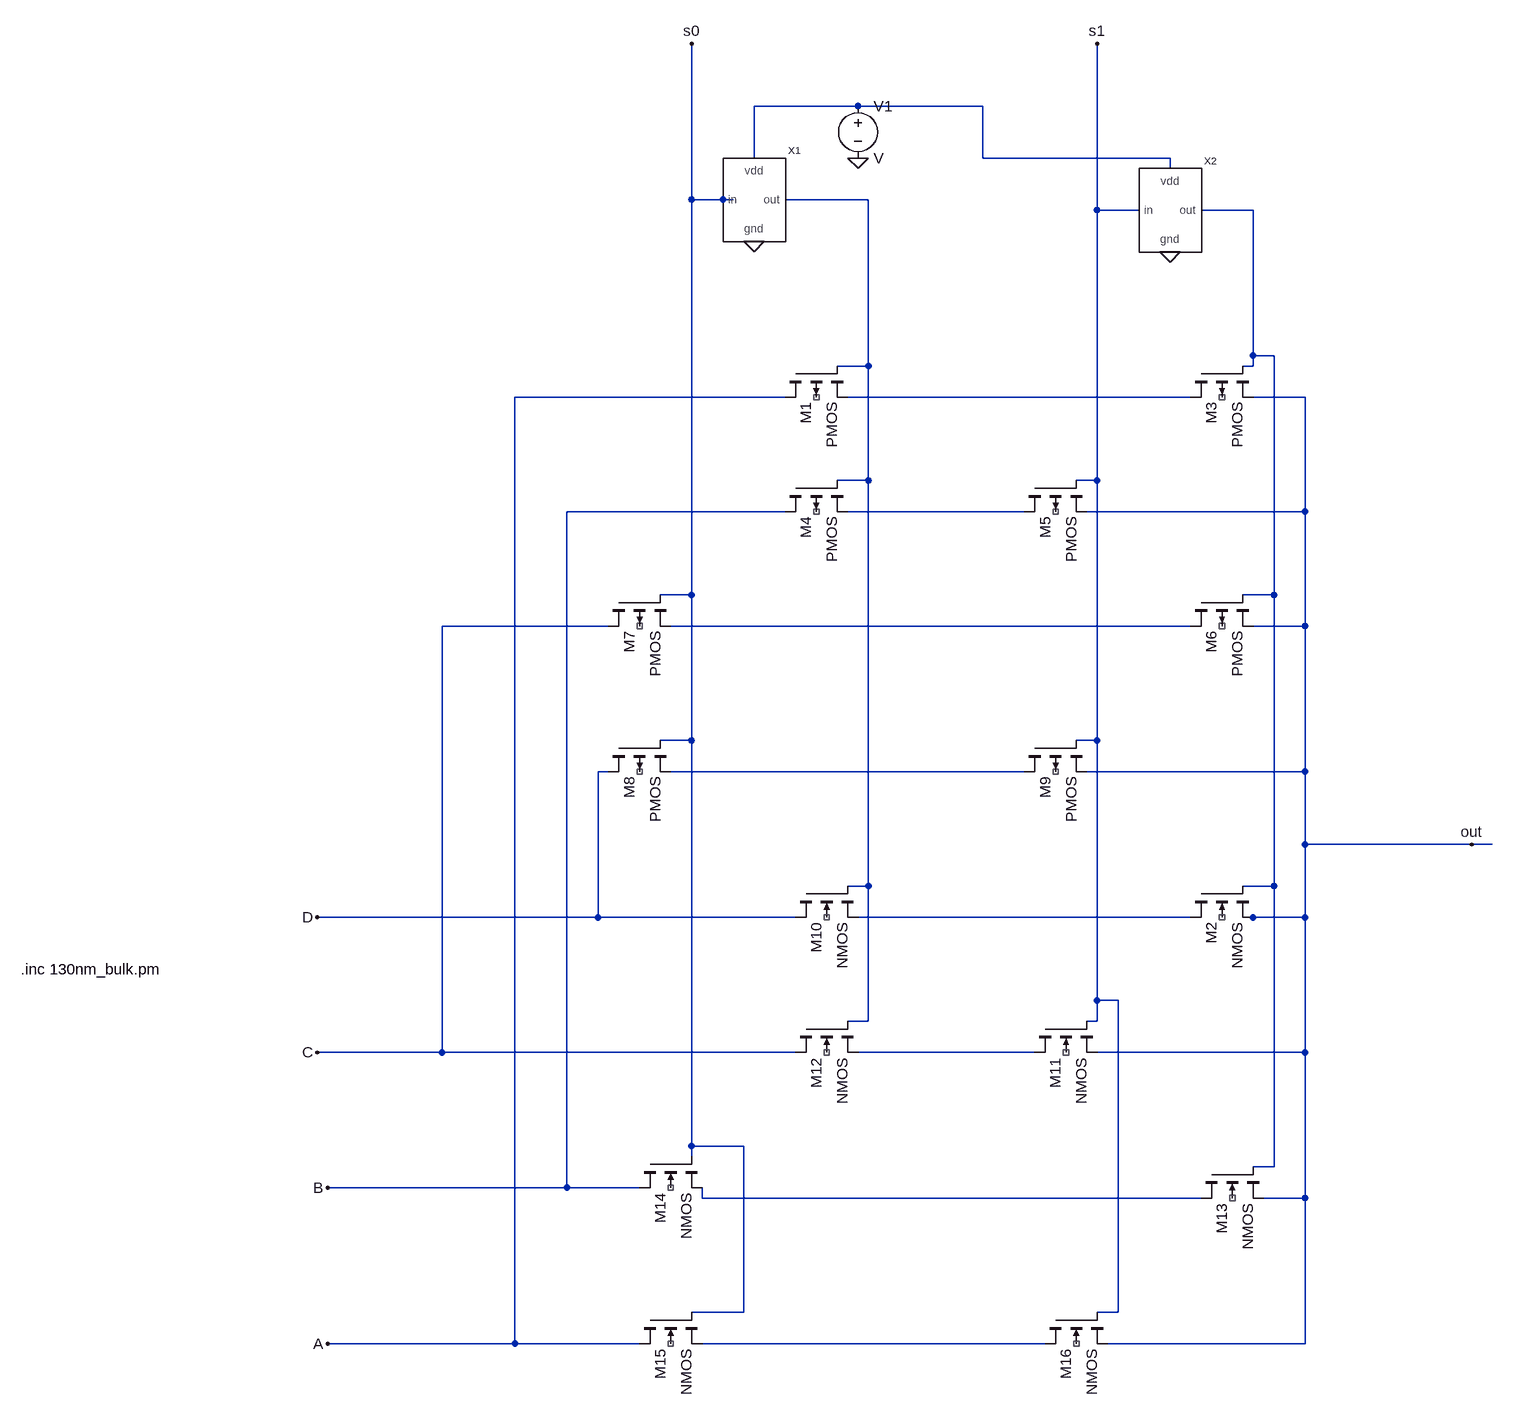
[diagram p0: schematic multiplexor.asc]
multiplexor.asc, the LTspice schematic file:
Version 4
SHEET 1 1380 724
WIRE 400 -1264 240 -1264
WIRE 592 -1264 400 -1264
WIRE 240 -1184 240 -1264
WIRE 592 -1184 592 -1264
WIRE 880 -1184 592 -1184
WIRE 880 -1168 880 -1184
WIRE 144 -1120 144 -1360
WIRE 192 -1120 144 -1120
WIRE 208 -1120 192 -1120
WIRE 416 -1120 288 -1120
WIRE 768 -1104 768 -1360
WIRE 832 -1104 768 -1104
WIRE 1008 -1104 928 -1104
WIRE 1008 -880 1008 -1104
WIRE 1040 -880 1008 -880
WIRE 416 -864 416 -1120
WIRE 416 -864 368 -864
WIRE 1008 -864 1008 -880
WIRE 1008 -864 992 -864
WIRE 288 -816 -128 -816
WIRE 912 -816 384 -816
WIRE 1088 -816 1008 -816
WIRE 416 -688 416 -864
WIRE 416 -688 368 -688
WIRE 768 -688 768 -1104
WIRE 768 -688 736 -688
WIRE 288 -640 -48 -640
WIRE 656 -640 384 -640
WIRE 1088 -640 1088 -816
WIRE 1088 -640 752 -640
WIRE 144 -512 144 -1120
WIRE 144 -512 96 -512
WIRE 1040 -512 1040 -880
WIRE 1040 -512 992 -512
WIRE 16 -464 -240 -464
WIRE 912 -464 112 -464
WIRE 1088 -464 1088 -640
WIRE 1088 -464 1008 -464
WIRE 144 -288 144 -512
WIRE 144 -288 96 -288
WIRE 768 -288 768 -688
WIRE 768 -288 736 -288
WIRE 16 -240 0 -240
WIRE 656 -240 112 -240
WIRE 1088 -240 1088 -464
WIRE 1088 -240 752 -240
WIRE 1088 -128 1088 -240
WIRE 1344 -128 1088 -128
WIRE 1376 -128 1344 -128
WIRE 416 -64 416 -688
WIRE 416 -64 384 -64
WIRE 1040 -64 1040 -512
WIRE 1040 -64 992 -64
WIRE 0 -16 0 -240
WIRE 0 -16 -432 -16
WIRE 304 -16 0 -16
WIRE 912 -16 400 -16
WIRE 1008 -16 992 -16
WIRE 1088 -16 1088 -128
WIRE 1088 -16 1008 -16
WIRE 768 112 768 -288
WIRE 800 112 768 112
WIRE 416 144 416 -64
WIRE 416 144 384 144
WIRE 768 144 768 112
WIRE 768 144 752 144
WIRE -240 192 -240 -464
WIRE -240 192 -432 192
WIRE 304 192 -240 192
WIRE 672 192 400 192
WIRE 1088 192 1088 -16
WIRE 1088 192 768 192
WIRE 144 336 144 -288
WIRE 224 336 144 336
WIRE 144 352 144 336
WIRE 1040 368 1040 -64
WIRE 1040 368 1008 368
WIRE -48 400 -48 -640
WIRE -48 400 -416 400
WIRE 64 400 -48 400
WIRE 160 416 160 400
WIRE 928 416 160 416
WIRE 1088 416 1088 192
WIRE 1088 416 1024 416
WIRE 224 592 224 336
WIRE 224 592 144 592
WIRE 800 592 800 112
WIRE 800 592 768 592
WIRE -128 640 -128 -816
WIRE -128 640 -416 640
WIRE 64 640 -128 640
WIRE 688 640 160 640
WIRE 1088 640 1088 416
WIRE 1088 640 784 640
FLAG 1344 -128 out
FLAG -416 640 A
FLAG -416 400 B
FLAG -432 192 C
FLAG -432 -16 D
FLAG 400 -1184 0
FLAG 240 -1056 0
FLAG 880 -1040 0
FLAG 144 -1360 s0
FLAG 768 -1360 s1
SYMBOL pmos4 288 -864 M90
SYMATTR InstName M1
SYMATTR Value2 l=130e-9 w=2600e-9 ad=676000e-18 as=676000e-18 pd=3640e-9 ps=3640e-9
SYMBOL nmos4 912 -64 M90
SYMATTR InstName M2
SYMATTR Value2 l=130e-9 w=1300e-9 ad=676000e-18 as=676000e-18 pd=3640e-9 ps=3640e-9
SYMBOL pmos4 912 -864 M90
SYMATTR InstName M3
SYMATTR Value2 l=130e-9 w=2600e-9 ad=676000e-18 as=676000e-18 pd=3640e-9 ps=3640e-9
SYMBOL pmos4 288 -688 M90
SYMATTR InstName M4
SYMATTR Value2 l=130e-9 w=2600e-9 ad=676000e-18 as=676000e-18 pd=3640e-9 ps=3640e-9
SYMBOL pmos4 656 -688 M90
SYMATTR InstName M5
SYMATTR Value2 l=130e-9 w=2600e-9 ad=676000e-18 as=676000e-18 pd=3640e-9 ps=3640e-9
SYMBOL pmos4 912 -512 M90
SYMATTR InstName M6
SYMATTR Value2 l=130e-9 w=2600e-9 ad=676000e-18 as=676000e-18 pd=3640e-9 ps=3640e-9
SYMBOL pmos4 16 -512 M90
SYMATTR InstName M7
SYMATTR Value2 l=130e-9 w=2600e-9 ad=676000e-18 as=676000e-18 pd=3640e-9 ps=3640e-9
SYMBOL pmos4 16 -288 M90
SYMATTR InstName M8
SYMATTR Value2 l=130e-9 w=2600e-9 ad=676000e-18 as=676000e-18 pd=3640e-9 ps=3640e-9
SYMBOL pmos4 656 -288 M90
SYMATTR InstName M9
SYMATTR Value2 l=130e-9 w=2600e-9 ad=676000e-18 as=676000e-18 pd=3640e-9 ps=3640e-9
SYMBOL nmos4 304 -64 M90
SYMATTR InstName M10
SYMATTR Value2 l=130e-9 w=1300e-9 ad=676000e-18 as=676000e-18 pd=3640e-9 ps=3640e-9
SYMBOL nmos4 672 144 M90
SYMATTR InstName M11
SYMATTR Value2 l=130e-9 w=1300e-9 ad=676000e-18 as=676000e-18 pd=3640e-9 ps=3640e-9
SYMBOL nmos4 304 144 M90
SYMATTR InstName M12
SYMATTR Value2 l=130e-9 w=1300e-9 ad=676000e-18 as=676000e-18 pd=3640e-9 ps=3640e-9
SYMBOL nmos4 928 368 M90
SYMATTR InstName M13
SYMATTR Value2 l=130e-9 w=1300e-9 ad=676000e-18 as=676000e-18 pd=3640e-9 ps=3640e-9
SYMBOL nmos4 64 352 M90
SYMATTR InstName M14
SYMATTR Value2 l=130e-9 w=1300e-9 ad=676000e-18 as=676000e-18 pd=3640e-9 ps=3640e-9
SYMBOL nmos4 64 592 M90
SYMATTR InstName M15
SYMATTR Value2 l=130e-9 w=1300e-9 ad=676000e-18 as=676000e-18 pd=3640e-9 ps=3640e-9
SYMBOL nmos4 688 592 M90
SYMATTR InstName M16
SYMATTR Value2 l=130e-9 w=1300e-9 ad=676000e-18 as=676000e-18 pd=3640e-9 ps=3640e-9
SYMBOL invert 240 -1120 R0
SYMATTR InstName X1
SYMBOL invert 880 -1104 R0
SYMATTR InstName X2
SYMBOL voltage 400 -1280 R0
SYMATTR InstName V1
TEXT -888 64 Left 2 !.inc 130nm_bulk.pm

The netlist it stands for:
* multiplexor.asc
M1 A N002 N004 NC_01 PMOS l=130e-9 w=2600e-9 ad=676000e-18 as=676000e-18 pd=3640e-9 ps=3640e-9
* M2: NMOS l=130e-9 w=1300e-9 ad=676000e-18 as=676000e-18 pd=3640e-9 ps=3640e-9 (symbol nmos4 not certain, pin order unknown); nets seen at it: N003, N008, out
M3 N004 N003 out NC_03 PMOS l=130e-9 w=2600e-9 ad=676000e-18 as=676000e-18 pd=3640e-9 ps=3640e-9
M4 B N002 N005 NC_04 PMOS l=130e-9 w=2600e-9 ad=676000e-18 as=676000e-18 pd=3640e-9 ps=3640e-9
M5 N005 s1 out NC_05 PMOS l=130e-9 w=2600e-9 ad=676000e-18 as=676000e-18 pd=3640e-9 ps=3640e-9
M6 N006 N003 out NC_06 PMOS l=130e-9 w=2600e-9 ad=676000e-18 as=676000e-18 pd=3640e-9 ps=3640e-9
M7 C s0 N006 NC_07 PMOS l=130e-9 w=2600e-9 ad=676000e-18 as=676000e-18 pd=3640e-9 ps=3640e-9
M8 D s0 N007 NC_08 PMOS l=130e-9 w=2600e-9 ad=676000e-18 as=676000e-18 pd=3640e-9 ps=3640e-9
M9 N007 s1 out NC_09 PMOS l=130e-9 w=2600e-9 ad=676000e-18 as=676000e-18 pd=3640e-9 ps=3640e-9
M10 D N002 N008 NC_10 NMOS l=130e-9 w=1300e-9 ad=676000e-18 as=676000e-18 pd=3640e-9 ps=3640e-9
M11 N009 s1 out NC_11 NMOS l=130e-9 w=1300e-9 ad=676000e-18 as=676000e-18 pd=3640e-9 ps=3640e-9
M12 C N002 N009 NC_12 NMOS l=130e-9 w=1300e-9 ad=676000e-18 as=676000e-18 pd=3640e-9 ps=3640e-9
M13 N010 N003 out NC_13 NMOS l=130e-9 w=1300e-9 ad=676000e-18 as=676000e-18 pd=3640e-9 ps=3640e-9
M14 B s0 N010 NC_14 NMOS l=130e-9 w=1300e-9 ad=676000e-18 as=676000e-18 pd=3640e-9 ps=3640e-9
M15 A s0 N011 NC_15 NMOS l=130e-9 w=1300e-9 ad=676000e-18 as=676000e-18 pd=3640e-9 ps=3640e-9
M16 N011 s1 out NC_16 NMOS l=130e-9 w=1300e-9 ad=676000e-18 as=676000e-18 pd=3640e-9 ps=3640e-9
XX1 s0 N001 0 N002 invert  ; pins in vdd gnd out
XX2 s1 N001 0 N003 invert  ; pins in vdd gnd out
V1 N001 0 V
.model NMOS NMOS
.model PMOS PMOS
.lib standard.mos
.inc 130nm_bulk.pm
.backanno
.end